# EAGLE design 74LVC2G157_breakout (EAGLE 9.2.2)
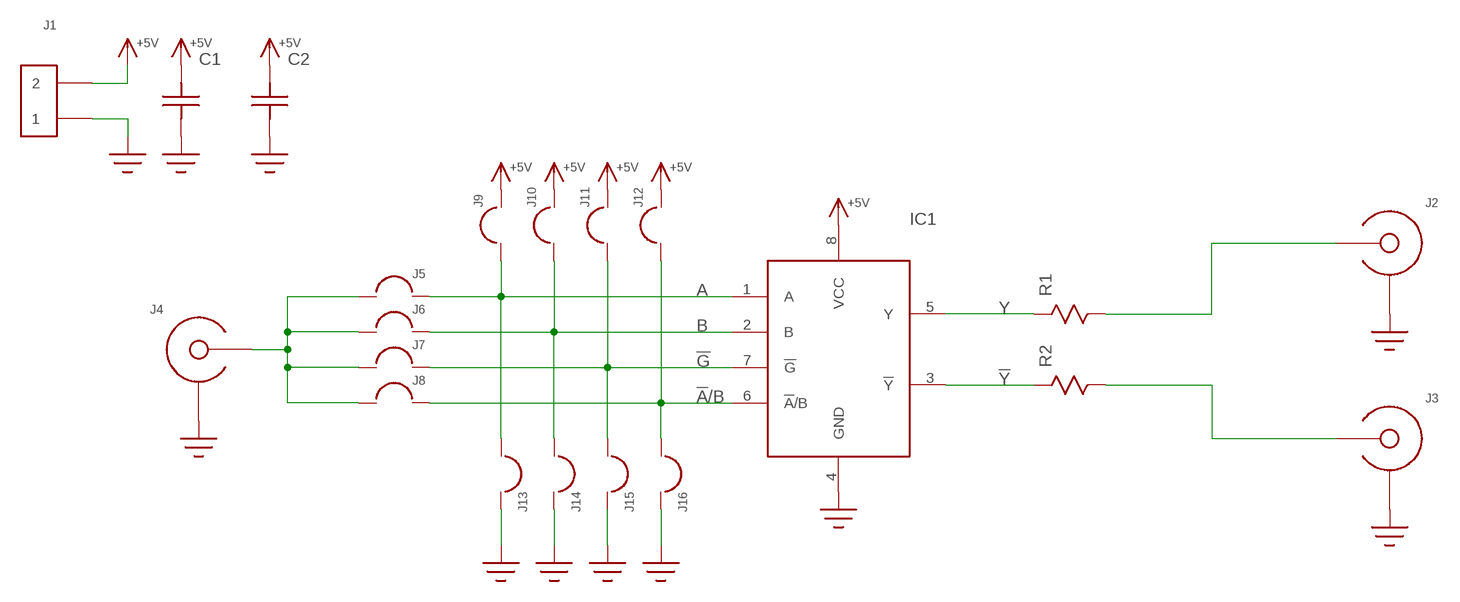
[diagram p0: schematic, sheet 1]

## Parts
C1  C0603  [C0603]
C2  C1206  [1206]
IC1  74LVC2G157  [SSOP8]
J1  HEADER_2PIN  [HEADER_2PIN]
J2  EDGE_LAUNCH_JACKNARROW  [EDGE_LAUNCH_RF_CON_NARROW]
J3  EDGE_LAUNCH_JACKNARROW  [EDGE_LAUNCH_RF_CON_NARROW]
J4  EDGE_LAUNCH_JACKNARROW  [EDGE_LAUNCH_RF_CON_NARROW]
J5  SOLDER_BRIDGE  [SOLDER_BRIDGE]
J6  SOLDER_BRIDGE  [SOLDER_BRIDGE]
J7  SOLDER_BRIDGE  [SOLDER_BRIDGE]
J8  SOLDER_BRIDGE  [SOLDER_BRIDGE]
J9  SOLDER_BRIDGE  [SOLDER_BRIDGE]
J10  SOLDER_BRIDGE  [SOLDER_BRIDGE]
J11  SOLDER_BRIDGE  [SOLDER_BRIDGE]
J12  SOLDER_BRIDGE  [SOLDER_BRIDGE]
J13  SOLDER_BRIDGE  [SOLDER_BRIDGE]
J14  SOLDER_BRIDGE  [SOLDER_BRIDGE]
J15  SOLDER_BRIDGE  [SOLDER_BRIDGE]
J16  SOLDER_BRIDGE  [SOLDER_BRIDGE]
R1  R0603  [R0603]
R2  R0603  [R0603]

## Nets
!A!/B: IC1.6(!A!/B) J8.2@1 J8.2@2 J8.2@3 J12.1 J16.1
!G!: IC1.7(!G!) J7.2@1 J7.2@2 J7.2@3 J11.1 J15.1
!Y!: IC1.3(!Y!) R2.P$1
+5V: C1.P$2 C2.P$2 IC1.8(VCC) J1.2 J9.2@1 J9.2@2 J9.2@3 J10.2@1 J10.2@2 J10.2@3 J11.2@1 J11.2@2 J11.2@3 J12.2@1 J12.2@2 J12.2@3
A: IC1.1(A) J5.2@1 J5.2@2 J5.2@3 J9.1 J13.1
B: IC1.2(B) J6.2@1 J6.2@2 J6.2@3 J10.1 J14.1
GND: C1.P$1 C2.P$1 IC1.4(GND) J1.1 J2.GND@1(SHIELD) J2.GND@2(SHIELD) J2.GND@3(SHIELD) J2.GND@4(SHIELD) J2.GND@5(SHIELD) J2.GND@6(SHIELD) J2.SHIELD@1(SHIELD) J2.SHIELD@2(SHIELD) J3.GND@1(SHIELD) J3.GND@2(SHIELD) J3.GND@3(SHIELD) J3.GND@4(SHIELD) J3.GND@5(SHIELD) J3.GND@6(SHIELD) J3.SHIELD@1(SHIELD) J3.SHIELD@2(SHIELD) J4.GND@1(SHIELD) J4.GND@2(SHIELD) J4.GND@3(SHIELD) J4.GND@4(SHIELD) J4.GND@5(SHIELD) J4.GND@6(SHIELD) J4.SHIELD@1(SHIELD) J4.SHIELD@2(SHIELD) J13.2@1 J13.2@2 J13.2@3 J14.2@1 J14.2@2 J14.2@3 J15.2@1 J15.2@2 J15.2@3 J16.2@1 J16.2@2 J16.2@3
N$3: J3.CENTER R2.P$2
N$4: J2.CENTER R1.P$2
N$5: J4.CENTER J5.1 J6.1 J7.1 J8.1
Y: IC1.5(Y) R1.P$1

## Library data of the parts
C1 C2 = yapo:C
IC1 = yapo:74LVC2G157
J1 = yapo:HEADER_2PIN
J2-J4 = yapo:EDGE_LAUNCH_JACK
J5-J16 = yapo:SOLDER_BRIDGE
R1 R2 = yapo:R

## Board
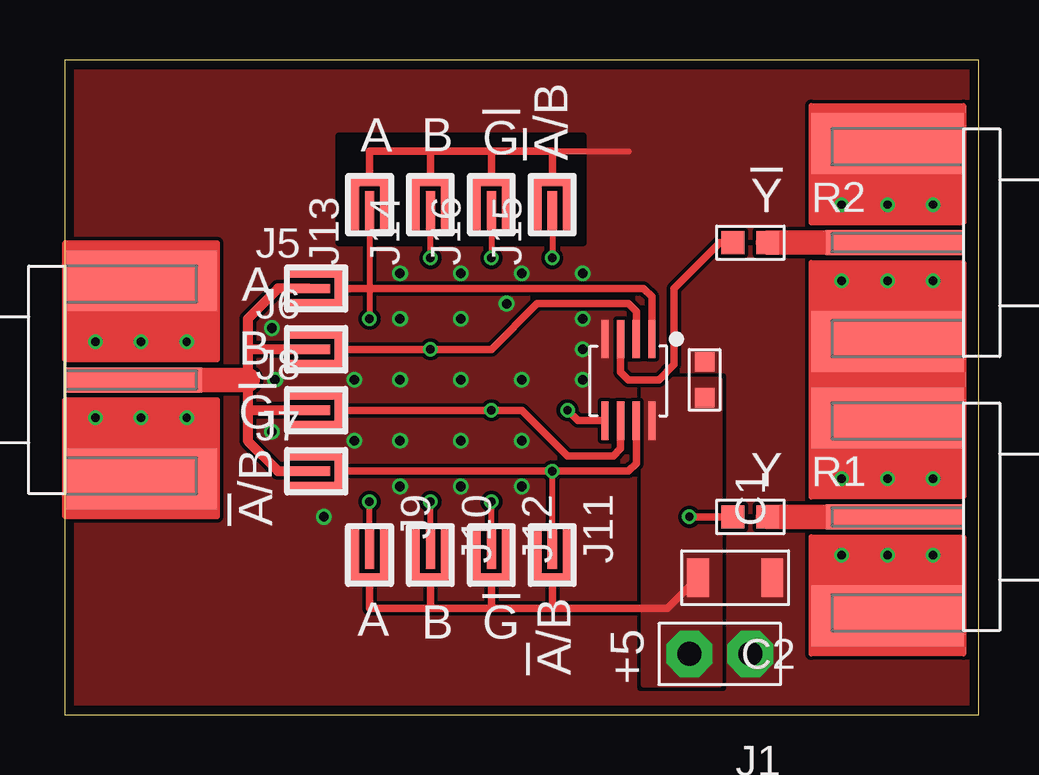
[diagram p1: board, top side]
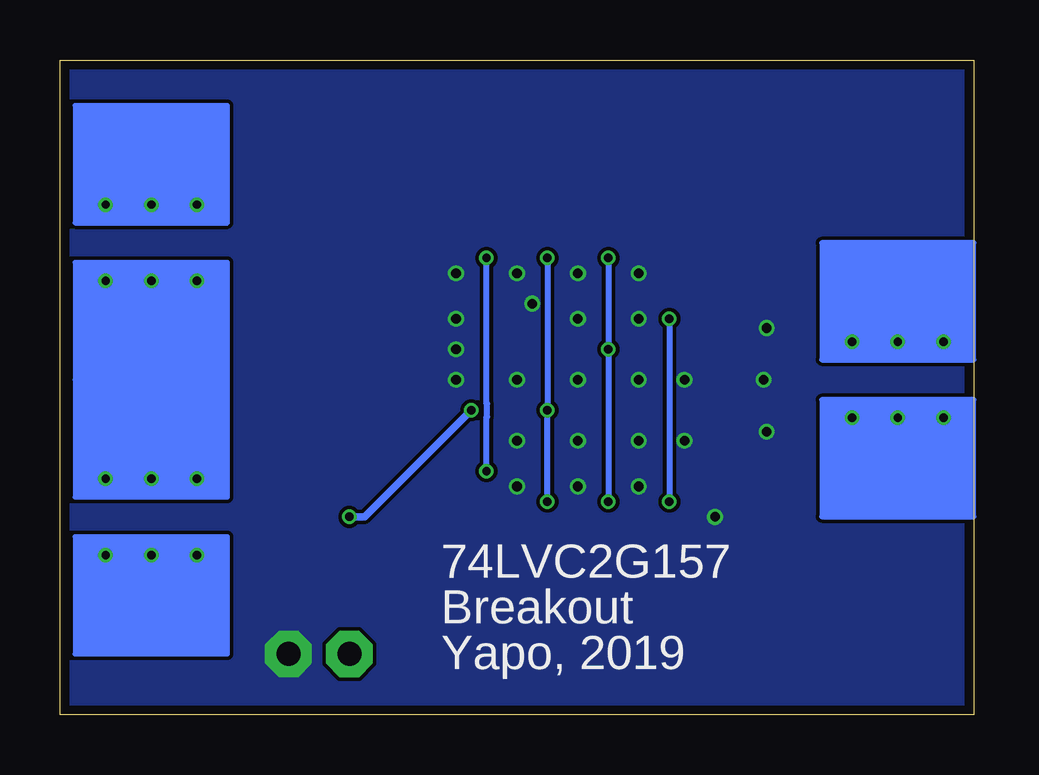
[diagram p2: board, bottom side, seen from below]

Size 38.1 x 27.3 mm. Coordinates in mm from the lower left corner, seen from the top.
Outline: 0,0 38.1,0 38.1,27.3 0,27.3 0,0
Copper layers (1*16): Top 0.035559375mm / dielectric 1.6mm / Bottom 0.035559375mm
Design rules "oshpark-2layer *": minimum track width 6mil, minimum drill 10mil, track to track 6mil, track to pad 6mil, pad to pad 6mil, via to via 6mil, smd to smd 6mil, copper to edge 15mil, drill to drill 6mil, minimum pad ring 5mil, minimum via ring 5mil, stop-mask expansion 2.5mil, vias tented up to drill 30mil, thermal gap 10mil
tRestrict: area 11.4,19.7 to 21.6,24.1

### Footprints (pad centres in the part's own frame; a part is rotated, then mirrored left to right if it is on the bottom)
C0603 = smd 0.8 x 0.8: P$1 -0.75,0; P$2 0.75,0
1206 = smd 0.9 x 1.6: P$1 -1.55,0; P$2 1.55,0
SSOP8 = smd 0.3 x 1.6: 1 -0.975,-1.7; 2 -0.325,-1.7; 3 0.325,-1.7; 4 0.975,-1.7; 5 0.975,1.7; 6 0.325,1.7; 7 -0.325,1.7; 8 -0.975,1.7
HEADER_2PIN = drill 1 pad 1.93 octagon: 1 -1.27,0; 2 1.27,0
EDGE_LAUNCH_RF_CON_NARROW = smd 5.715 x 1.041: CENTER -2.875,0 | drill 0.35: GND@1 -5.08,1.587; GND@2 -3.175,1.587; GND@3 -1.27,1.587; GND@4 -5.08,-1.587; GND@5 -3.175,-1.587; GND@6 -1.27,-1.587 | smd 6.35 x 2.54: SHIELD@1 -3.175,-4.128; SHIELD@2 -3.175,4.128
SOLDER_BRIDGE = smd 1.778 x 0.381: 1 0,0 | smd 0.381 x 1.27: 2@1 1.27,0 | smd 2.286 x 0.381: 2@2 0.318,0.635; 2@3 0.318,-0.635
R0603 = smd 0.95 x 0.95: P$1 -0.725,0; P$2 0.725,0

### Placement (x,y rotation side)
C1  26.67,13.97 270 top
C2  27.94,5.71 180 top
IC1  23.5,13.97 180 top
J1  27.3,2.54 180 top
J2  37.47,8.26 0 top
J3  37.47,19.68 0 top
J4  0,13.97 180 top
J5  10.16,17.78 0 top
J6  10.16,15.24 0 top
J7  10.16,10.16 0 top
J8  10.16,12.7 0 top
J9  12.7,6.99 270 top
J10  15.24,6.99 270 top
J11  20.32,6.99 270 top
J12  17.78,6.99 270 top
J13  12.7,20.95 90 top
J14  15.24,20.95 90 top
J15  20.32,20.95 90 top
J16  17.78,20.95 90 top
R1  28.57,8.26 0 top
R2  28.57,19.68 0 top

### Tracks (layer width: path | path; a pad name or v marks a point on that pad's centre or on a via)
!A!/B  (via drill 0.35)
  Top 0.152: J8.2@2 11.43,13.34 J8.2@1 11.43,12.06 J8.2@3
  Top 0.254: J16.1 v17.78,19.05 | J12.1 v17.78,8.89
  Top 0.305: J8.2@1 v17.78,12.7 19.05,12.7 20.95,10.79 22.86,10.79 23.17,11.11 IC1.6
  Bottom 0.254: v17.78,19.05 v17.78,12.7 v17.78,8.89
!G!  (via drill 0.35)
  Top 0.152: J7.2@2 11.43,10.79 J7.2@1 11.43,9.53 J7.2@3
  Top 0.254: J15.1 v20.32,19.05 | J11.1 v20.32,10.16
  Top 0.305: J7.2@1 v20.32,10.16 23.5,10.16 23.82,10.48 IC1.7
  Bottom 0.254: v20.32,10.16 20.32,12.4 20.3,12.43 20.3,12.97 20.32,12.99 v20.32,19.05
!Y!
  Top 0.305: IC1.3 23.17,14.29 23.5,13.97 24.77,13.97 25.4,14.61 25.4,17.78 27.3,19.68 R2.P$1
+5V
  Top 0.152: J9.2@3 12.06,5.71 J9.2@1 13.34,5.71 J9.2@2 | J10.2@3 14.61,5.71 J10.2@1 15.88,5.71 J10.2@2 | J12.2@3 17.14,5.71 J12.2@1 18.41,5.71 J12.2@2 | J11.2@3 19.68,5.71 J11.2@1 20.95,5.71 J11.2@2
  Top 0.305: J9.2@1 12.7,4.45 15.24,4.45 | 15.24,4.45 17.78,4.45 | 17.78,4.45 20.32,4.45 | 20.32,4.45 25.12,4.45 C2.P$2 | J10.2@1 15.24,4.45 | J12.2@1 17.78,4.45 | J11.2@1 20.32,4.45
  pour Top (no thermals): 24.13,13.97 24.13,1.27 27.3,1.27 27.3,13.97
A  (via drill 0.35)
  Top 0.152: J5.2@2 11.43,18.41 J5.2@1 11.43,17.14 J5.2@3
  Top 0.254: v12.7,16.51 12.7,17.78 J13.1 | J9.1 v12.7,8.89
  Top 0.305: IC1.1 24.47,17.44 24.13,17.78 12.7,17.78 J5.2@1
  Bottom 0.254: v12.7,16.51 v12.7,8.89
B  (via drill 0.35)
  Top 0.152: J6.2@2 11.43,15.88 J6.2@1 11.43,14.61 J6.2@3
  Top 0.254: v15.24,19.05 J14.1 | J10.1 v15.24,8.89
  Top 0.305: J6.2@1 v15.24,15.24 17.78,15.24 19.68,17.14 23.5,17.14 23.82,16.82 IC1.2
  Bottom 0.254: v15.24,19.05 v15.24,15.24 v15.24,8.89
GND  (via drill 0.4)
  Top 0.152: J13.2@2 12.06,22.23 J13.2@1 13.34,22.23 J13.2@3 | J14.2@2 14.61,22.23 J14.2@1 15.88,22.23 J14.2@3 | J16.2@2 17.14,22.23 J16.2@1 18.41,22.23 J16.2@3 | J15.2@2 19.68,22.23 J15.2@1 20.95,22.23 J15.2@3
  Top 0.254: 20.32,23.5 23.5,23.5
  Top 0.305: J13.2@1 12.7,23.5 15.24,23.5 | 15.24,23.5 17.78,23.5 | 17.78,23.5 20.32,23.5 J15.2@1 | J16.2@1 17.78,23.5 | J14.2@1 15.24,23.5
  other vias: 21.59,16.51 21.59,15.24 21.59,13.97 21.59,18.41 19.05,18.41 16.51,18.41 13.97,18.41 16.51,16.51 13.97,16.51 13.97,13.97 16.51,13.97 16.51,11.43 13.97,11.43 19.05,11.43 19.05,13.97 18.41,17.14 13.97,9.53 16.51,9.53 19.05,9.53 12.06,13.97 12.06,11.43 10.79,8.26 8.64,11.81 8.76,13.97 8.64,16.13
  pour Top (rank 2, no thermals): 0,0 38.1,0 38.1,27.3 0,27.3
  pour Bottom (no thermals): 0,0 38.1,0 38.1,27.3 0,27.3
N$3
  Top 1.016: J3.CENTER R2.P$2
N$4
  Top 1.016: J2.CENTER R1.P$2
N$5
  Top 0.406: J5.1 8.89,17.78 7.62,16.51 7.62,15.24 | 7.62,15.24 7.62,13.97 7.62,12.7 | 7.62,12.7 7.62,11.43 8.89,10.16 J7.1 | J6.1 7.62,15.24 | J8.1 7.62,12.7
  Top 1.016: 7.62,13.97 J4.CENTER
Y  (via drill 0.35)
  Top 0.305: IC1.5 21.39,12.27 v20.95,12.7 | v26.04,8.26 R1.P$1
  Bottom 0.305: v20.95,12.7 25.4,8.26 v26.04,8.26

### Text on the board
tPlace: A | B | !G! | !A!/B | !Y! | A | B | !G! | Y | !A!/B | A | B | !G! | !A!/B | +5
bPlace: 74LVC2G157 | Breakout | Yapo, 2019